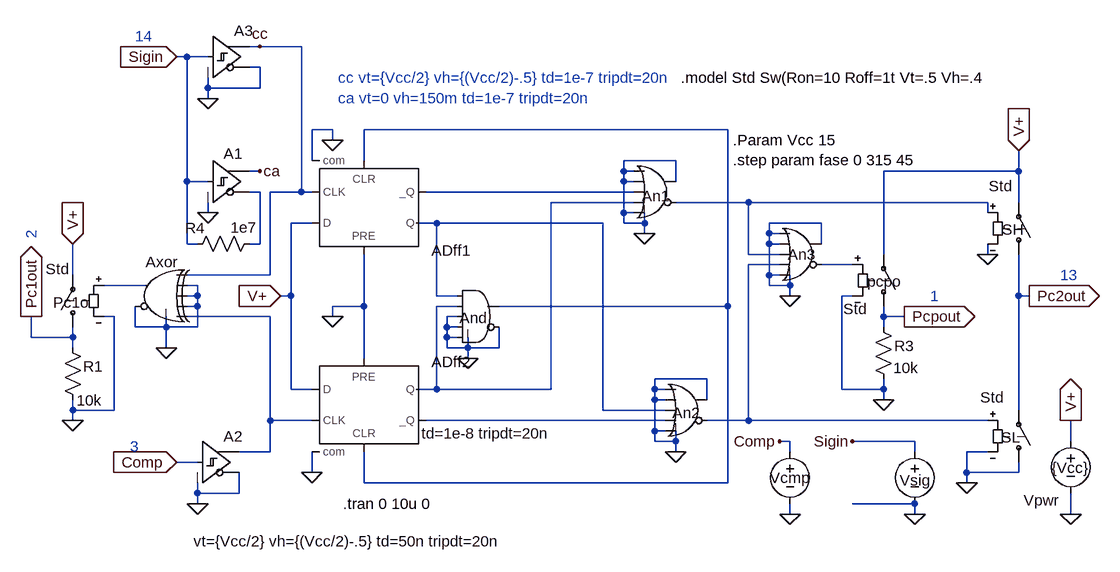
[diagram p0: schematic DF3a.asc]
DF3a.asc, the LTspice schematic file:
Version 4
SHEET 1 1280 872
WIRE -672 400 -672 368
WIRE -608 304 -608 256
WIRE -608 400 -672 400
WIRE -608 400 -608 384
WIRE -608 416 -608 400
WIRE -608 512 -608 496
WIRE -608 528 -608 512
WIRE -544 368 -560 368
WIRE -544 512 -608 512
WIRE -544 512 -544 368
WIRE -512 384 -512 352
WIRE -496 320 -560 320
WIRE -464 384 -512 384
WIRE -464 384 -464 368
WIRE -464 416 -464 384
WIRE -432 -32 -448 -32
WIRE -432 160 -432 -32
WIRE -432 256 -432 160
WIRE -416 256 -432 256
WIRE -416 320 -432 320
WIRE -416 336 -432 336
WIRE -416 336 -416 320
WIRE -416 352 -432 352
WIRE -416 352 -416 336
WIRE -416 384 -464 384
WIRE -416 384 -416 352
WIRE -416 592 -448 592
WIRE -416 640 -416 624
WIRE -416 656 -416 640
WIRE -400 -32 -432 -32
WIRE -400 16 -400 0
WIRE -400 32 -400 16
WIRE -400 160 -432 160
WIRE -400 208 -400 192
WIRE -352 640 -416 640
WIRE -352 640 -352 608
WIRE -320 -48 -336 -48
WIRE -320 -16 -336 -16
WIRE -320 16 -400 16
WIRE -320 16 -320 -16
WIRE -320 144 -336 144
WIRE -320 176 -336 176
WIRE -320 256 -336 256
WIRE -320 256 -320 176
WIRE -304 304 -432 304
WIRE -304 304 -304 176
WIRE -304 368 -432 368
WIRE -304 528 -304 368
WIRE -304 576 -352 576
WIRE -304 576 -304 528
WIRE -272 336 -288 336
WIRE -272 336 -272 224
WIRE -272 480 -272 336
WIRE -256 -48 -320 -48
WIRE -256 176 -304 176
WIRE -256 176 -256 -48
WIRE -240 128 -240 80
WIRE -240 176 -256 176
WIRE -240 224 -272 224
WIRE -240 480 -272 480
WIRE -240 528 -304 528
WIRE -240 608 -240 576
WIRE -208 80 -240 80
WIRE -208 96 -208 80
WIRE -208 368 -208 352
WIRE -160 128 -160 80
WIRE -160 352 -208 352
WIRE -160 352 -160 272
WIRE -160 432 -160 352
WIRE -160 624 -160 576
WIRE -48 224 -80 224
WIRE -48 336 -48 224
WIRE -48 480 -80 480
WIRE -48 480 -48 352
WIRE -32 384 -32 368
WIRE -32 400 -32 384
WIRE -32 416 -32 400
WIRE -16 336 -48 336
WIRE -16 352 -48 352
WIRE -16 368 -32 368
WIRE -16 384 -32 384
WIRE -16 400 -32 400
WIRE 0 416 -32 416
WIRE 0 416 0 400
WIRE 0 432 0 416
WIRE 48 416 0 416
WIRE 48 416 48 384
WIRE 128 480 -48 480
WIRE 128 480 128 192
WIRE 208 224 -48 224
WIRE 208 512 208 224
WIRE 240 144 240 128
WIRE 240 160 240 144
WIRE 240 208 240 160
WIRE 240 224 240 208
WIRE 256 144 240 144
WIRE 256 160 240 160
WIRE 256 176 -64 176
WIRE 256 192 128 192
WIRE 256 208 240 208
WIRE 272 224 240 224
WIRE 272 224 272 208
WIRE 272 240 272 224
WIRE 288 480 288 464
WIRE 288 496 288 480
WIRE 288 544 288 496
WIRE 288 560 288 544
WIRE 304 480 288 480
WIRE 304 496 288 496
WIRE 304 512 208 512
WIRE 304 528 -64 528
WIRE 304 544 288 544
WIRE 320 128 240 128
WIRE 320 160 320 128
WIRE 320 560 288 560
WIRE 320 560 320 544
WIRE 320 576 320 560
WIRE 368 464 288 464
WIRE 368 496 368 464
WIRE 400 80 -160 80
WIRE 400 352 48 352
WIRE 400 352 400 80
WIRE 400 624 -160 624
WIRE 400 624 400 352
WIRE 432 192 320 192
WIRE 432 272 432 192
WIRE 432 528 368 528
WIRE 432 528 432 288
WIRE 464 240 464 224
WIRE 464 256 464 240
WIRE 464 304 464 256
WIRE 464 320 464 304
WIRE 480 240 464 240
WIRE 480 256 464 256
WIRE 480 272 432 272
WIRE 480 288 432 288
WIRE 480 304 464 304
WIRE 496 320 464 320
WIRE 496 320 496 304
WIRE 496 336 496 320
WIRE 496 560 480 560
WIRE 496 576 496 560
WIRE 496 672 496 656
WIRE 544 224 464 224
WIRE 544 256 544 224
WIRE 576 480 576 336
WIRE 592 288 544 288
WIRE 592 336 576 336
WIRE 640 272 640 144
WIRE 640 368 640 352
WIRE 640 384 640 368
WIRE 640 480 576 480
WIRE 640 480 640 464
WIRE 640 496 640 480
WIRE 672 368 640 368
WIRE 688 560 592 560
WIRE 688 576 688 560
WIRE 688 656 592 656
WIRE 688 672 688 656
WIRE 768 608 768 576
WIRE 768 624 768 608
WIRE 800 192 432 192
WIRE 800 208 800 192
WIRE 800 272 800 256
WIRE 800 528 432 528
WIRE 800 576 768 576
WIRE 848 144 640 144
WIRE 848 144 848 112
WIRE 848 192 848 144
WIRE 848 336 848 272
WIRE 848 512 848 336
WIRE 848 608 768 608
WIRE 848 608 848 592
WIRE 864 336 848 336
WIRE 928 560 928 528
WIRE 928 672 928 640
FLAG 928 672 0
FLAG 928 528 V+
IOPIN 928 528 Out
FLAG -288 336 V+
IOPIN -288 336 In
FLAG -448 592 Comp
IOPIN -448 592 In
FLAG 672 368 Pcpout
IOPIN 672 368 Out
FLAG 848 112 V+
IOPIN 848 112 In
FLAG 768 624 0
FLAG 864 336 Pc2out
IOPIN 864 336 Out
FLAG -208 368 0
FLAG -672 368 Pc1out
IOPIN -672 368 Out
FLAG 688 672 0
FLAG 496 672 0
FLAG 480 560 Comp
FLAG 592 560 Sigin
FLAG 640 496 0
FLAG -240 608 0
FLAG -208 96 0
FLAG 320 576 0
FLAG -400 208 0
FLAG -416 656 0
FLAG -464 416 0
FLAG 496 336 0
FLAG 0 432 0
FLAG 272 240 0
FLAG -608 528 0
FLAG -608 256 V+
IOPIN -608 256 In
FLAG 800 272 0
FLAG -400 32 0
FLAG -448 -32 Sigin
IOPIN -448 -32 In
FLAG -320 144 ca
FLAG -320 -48 cc
SYMBOL voltage 928 544 R0
WINDOW 3 -29 57 Left 0
WINDOW 123 0 0 Left 0
WINDOW 0 -72 107 Left 0
SYMATTR Value {Vcc}
SYMATTR InstName Vpwr
SYMATTR SpiceLine Rser=10 Cpar=1u
SYMBOL voltage 688 560 R0
WINDOW 0 -23 60 Left 0
WINDOW 3 -55 -21 Invisible 0
WINDOW 123 0 0 Left 0
WINDOW 39 0 0 Left 0
SYMATTR InstName Vsig
SYMATTR Value SINE({Vcc/2} {Vcc/2} 2e6 0 0 {fase})
SYMBOL voltage 496 560 R0
WINDOW 0 -31 56 Left 0
WINDOW 3 -93 -7 Invisible 0
WINDOW 123 0 0 Left 0
WINDOW 39 0 0 Left 0
SYMATTR InstName Vcmp
SYMATTR Value SINE({Vcc/2} {Vcc/2} 2e6 0 0)
SYMBOL Digital\\dflop -160 432 R0
SYMATTR InstName ADff2
SYMBOL Digital\\dflop -160 272 M180
SYMATTR InstName ADff1
SYMBOL Digital\\or 288 112 R0
WINDOW 0 -20 70 Left 0
SYMATTR InstName An1
SYMBOL Digital\\or 336 448 R0
WINDOW 0 -21 68 Left 0
SYMATTR InstName An2
SYMBOL Digital\\xor -480 272 M0
WINDOW 0 -34 12 Left 0
SYMATTR InstName Axor
SYMBOL Digital\\or 512 208 R0
WINDOW 0 -19 64 Left 0
SYMATTR InstName An3
SYMBOL Digital\\and 16 304 R0
WINDOW 0 -29 66 Left 0
WINDOW 3 -87 244 Left 0
SYMATTR InstName And
SYMATTR Value td=1e-8 tripdt=20n
SYMBOL sw 848 288 M180
WINDOW 0 -25 54 Left 0
WINDOW 3 -46 121 Left 0
SYMATTR InstName SH
SYMATTR Value Std
SYMBOL sw 848 608 M180
WINDOW 0 -27 54 Left 0
WINDOW 3 -59 116 Left 0
SYMATTR InstName SL
SYMATTR Value Std
SYMBOL sw 640 368 M180
WINDOW 0 -25 54 Left 0
WINDOW 3 -62 12 Left 0
SYMATTR InstName pcpo
SYMATTR Value Std
SYMBOL res 656 480 R180
WINDOW 0 -31 67 Left 0
WINDOW 3 -38 33 Left 0
SYMATTR InstName R3
SYMATTR Value 10k
SYMBOL sw -608 400 R180
WINDOW 0 -25 54 Left 0
WINDOW 3 6 105 Left 0
SYMATTR InstName Pc1o
SYMATTR Value Std
SYMBOL res -624 400 R0
WINDOW 0 32 45 Left 0
WINDOW 3 22 97 Left 0
SYMATTR InstName R1
SYMATTR Value 10k
SYMBOL Digital\\schmitt -416 528 R0
WINDOW 3 -6 186 Left 0
SYMATTR Value vt={Vcc/2} vh={(Vcc/2)-.5} td=50n tripdt=20n
SYMATTR InstName A2
SYMBOL Digital\\schmitt -400 96 R0
WINDOW 3 -181 102 Invisible 0
WINDOW 0 24 21 Left 0
SYMATTR Value vt=0 vh=150m td=50n tripdt=20n
SYMATTR InstName A1
SYMBOL Digital\\schmitt -400 -96 R0
WINDOW 3 108 39 Invisible 0
SYMATTR Value vt={Vcc/2} vh={(Vcc/2)-.5} td=50n tripdt=20n
SYMATTR InstName A3
SYMBOL res -320 240 R90
WINDOW 0 7 100 VBottom 0
WINDOW 3 -25 25 VTop 0
SYMATTR InstName R4
SYMATTR Value 1e7
TEXT 408 96 Left 0 !.Param Vcc 15\n.step param fase 0 315 45
TEXT -512 -64 Left 0 ;14
TEXT -520 568 Left 0 ;3
TEXT -672 248 VLeft 0 ;2
TEXT 912 304 Left 0 ;13
TEXT 712 336 Left 0 ;1
TEXT -192 656 Left 0 !.tran 0 10u 0
TEXT 328 0 Left 0 !.model Std Sw(Ron=10 Roff=1t Vt=.5 Vh=.4
TEXT -200 0 Left 0 ;cc vt={Vcc/2} vh={(Vcc/2)-.5} td=1e-7 tripdt=20n\nca vt=0 vh=150m td=1e-7 tripdt=20n

The netlist it stands for:
* DF3a.asc
Vpwr V+ 0 {Vcc} Rser=10 Cpar=1u
Vsig Sigin 0 SINE({Vcc/2} {Vcc/2} 2e6 0 0 {fase})
Vcmp Comp 0 SINE({Vcc/2} {Vcc/2} 2e6 0 0)
ADff2 V+ 0 N003 0 N004 N008 N006 0 DFLOP
ADff1 V+ 0 cc 0 N004 N007 N005 0 DFLOP
An1 0 0 N007 N006 0 N009 0 0 OR
An2 0 0 N005 N008 0 N010 0 0 OR
Axor cc 0 0 0 N003 0 N001 0 XOR
An3 0 0 N009 N010 0 N011 0 0 OR
And N005 N006 0 0 0 0 N004 0 AND td=1e-8 tripdt=20n
SH Pc2out V+ N009 0 Std
SL 0 Pc2out N010 0 Std
S§pcpo Pcpout V+ N011 0 Std
R3 0 Pcpout 10k
S§Pc1o Pc1out V+ N001 0 Std
R1 Pc1out 0 10k
A2 Comp 0 0 0 0 0 N003 0 SCHMITT vt={Vcc/2} vh={(Vcc/2)-.5} td=50n tripdt=20n
A1 Sigin 0 0 0 0 N002 ca 0 SCHMITT vt=0 vh=150m td=50n tripdt=20n
A3 Sigin 0 0 0 0 0 cc 0 SCHMITT vt={Vcc/2} vh={(Vcc/2)-.5} td=50n tripdt=20n
R4 N002 Sigin 1e7
.Param Vcc 15
.step param fase 0 315 45
* 14
* 3
* 2
* 13
* 1
.tran 0 10u 0
.model Std Sw(Ron=10 Roff=1t Vt=.5 Vh=.4
* cc vt={Vcc/2} vh={(Vcc/2)-.5} td=1e-7 tripdt=20n
* ca vt=0 vh=150m td=1e-7 tripdt=20n
.backanno
.end